# Altium schematic sheet audio.SchDoc
size A4
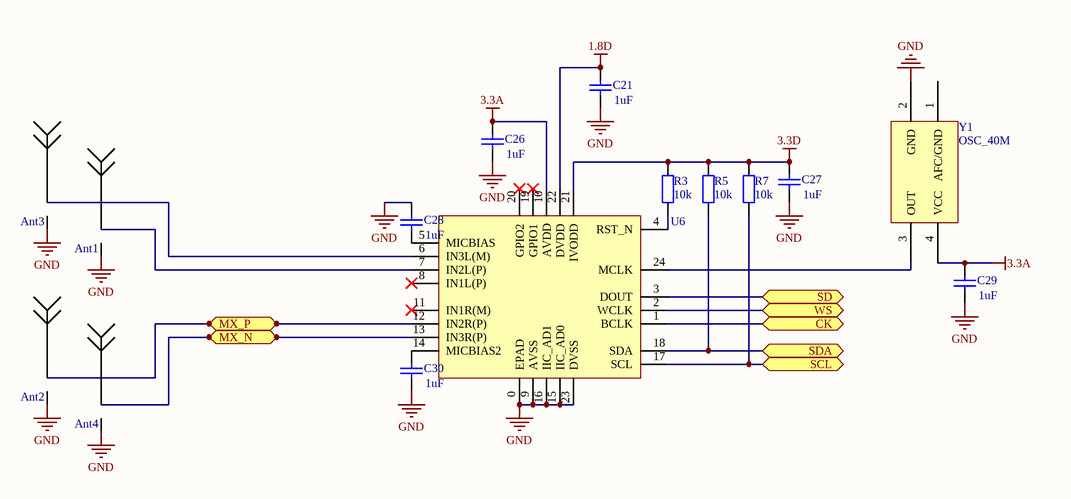
[diagram p0: audio.SchDoc]

## Parts
Ant1  Antenna  [SMA]  (value not drawn)
Ant2  Antenna  [SMA]  (value not drawn)
Ant3  Antenna  [SMA]  (value not drawn)
Ant4  Antenna  [SMA]  (value not drawn)
C21  1uF  [0402]
C26  1uF  [0402]
C27  1uF  [0402]
C28  1uF  [0402]
C29  1uF  [0402]
C30  1uF  [0402]
R3  value 10k  [0402]  (hidden comment: Res2)
R5  value 10k  [0402]  (hidden comment: Res2)
R7  value 10k  [0402]  (hidden comment: Res2)
U6  TLV320ADC3101  [TLV320ADC3101]  (value not drawn)
Y1  OSC_40M  [TXC_7Q]

## Ports
CK, MX_N, MX_P, SCL, SD, SDA, WS

## Nets
1.8D: C21.2 U6.22(DVDD)
3.3A: C26.2 C29.2 U6.10(AVDD) Y1.4(VCC)
3.3D: C27.2 R3.2 R5.2 R7.2 U6.21(IVODD)
GND: Ant1.GND(G) Ant2.GND(G) Ant3.GND(G) Ant4.GND(G) C21.1 C26.1 C27.1 C28.2 C29.1 C30.1 U6.0(EPAD) U6.9(AVSS) U6.15(IIC_AD0) U6.16(IIC_AD1) U6.23(DVSS) Y1.2(GND)
CK: U6.1(BCLK) ; port CK
MX_N: Ant4.1 U6.13(IN3R(P)) ; port MX_N
MX_P: Ant2.1 U6.12(IN2R(P)) ; port MX_P
SCL: R7.1 U6.17(SCL) ; port SCL
SD: U6.3(DOUT) ; port SD
SDA: R5.1 U6.18(SDA) ; port SDA
WS: U6.2(WCLK) ; port WS
NetAnt1_1: Ant1.1 U6.7(IN2L(P))
NetAnt3_1: Ant3.1 U6.6(IN3L(M))
NetC28_1: C28.1 U6.5(MICBIAS)
NetC30_2: C30.2 U6.14(MICBIAS2)
NetR3_1: R3.1 U6.4(RST_N)
NetU6_24: U6.24(MCLK) Y1.3(OUT)

Not connected (* = marked no-connect by the designer): U6 8(IN1L(P))* 11(IN1R(M))* 19(GPIO1)* 20(GPIO2)*; Y1 1(AFC/GND)

## Library data of the parts
C21 C26-C30 = Cap: Capacitor
R3 R5 R7 = Res2: Resistor; Published: 8-Jun-2000; LatestRevisionDate: 17-Jul-2002; LatestRevisionNote: Re-released for DXP Platform.; PackageReference: AXIAL-0.4; Publisher: Altium Limited; PackageDescription: Axial Device, Thru-Hole; 2 Leads; 0.4 in Pin Spacing